# EAGLE schematic ACS schematic (EAGLE 8.6.0)
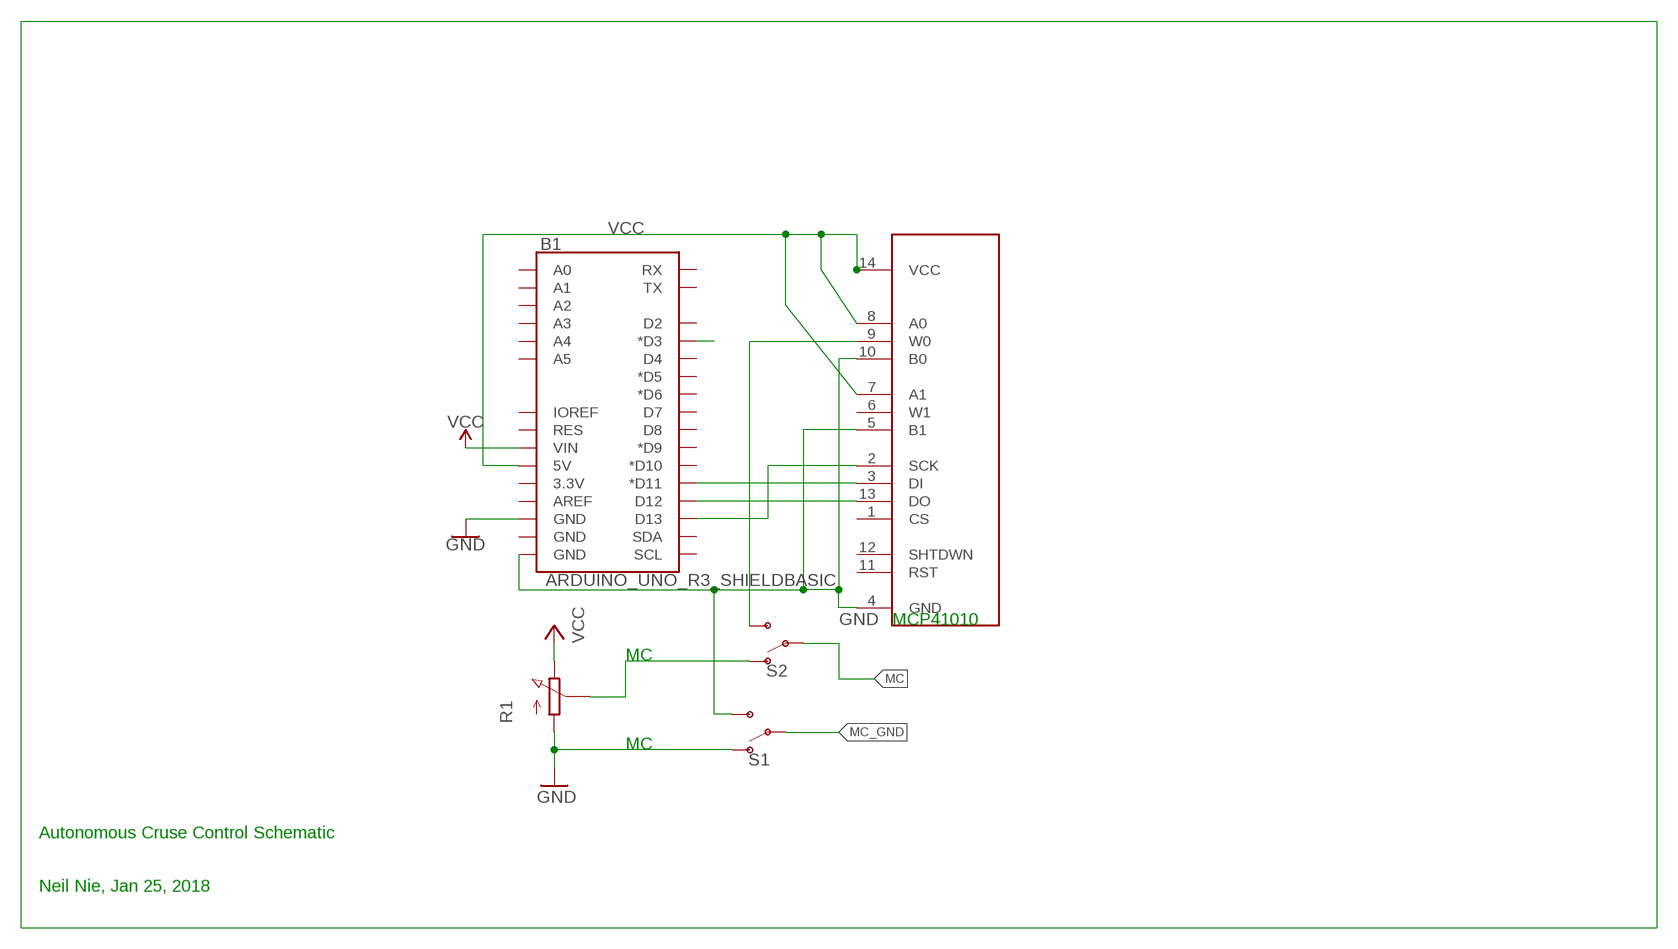
[diagram p0: schematic, sheet 1]

## Parts
B1  ARDUINO_UNO_R3_SHIELDBASIC  [UNO_R3_SHIELD]
MCP41010  MCP42XXX  [SO014]
R1  PC25  [PC25]
S1  SWITCH-SPDT-PTH-11.6X4.0MM  [SWITCH_SPDT_PTH_11.6X4.0MM]
S2  SWITCH-SPDT-PTH-11.6X4.0MM  [SWITCH_SPDT_PTH_11.6X4.0MM]

## Nets
GND: B1.GND@0(GND) B1.GND@2(GND) MCP41010.4(GND) MCP41010.5(B1) MCP41010.10(B0) R1.A S1.1(O) S1.3(S)
MC: S2.2(P)
MC_GND: S1.2(P)
N$1: B1.D13 MCP41010.2(SCK)
N$2: B1.D11(*D11) MCP41010.3(DI)
N$3: B1.D12 MCP41010.13(DO)
N$9: B1.D3(*D3)
N$10: R1.S S2.1(O)
VCC: B1.5V B1.VIN MCP41010.7(A1) MCP41010.8(A0) MCP41010.14(VCC) R1.E
W0: MCP41010.9(W0) S2.3(S)
Unconnected: B1.3.3V B1.A0 B1.A1 B1.A2 B1.A3 B1.A4 B1.A5 B1.AREF B1.D2 B1.D4 B1.D5(*D5) B1.D6(*D6) B1.D7 B1.D8 B1.D9(*D9) B1.D10(*D10) B1.GND@1(GND) B1.IOREF B1.RES B1.RX B1.SCL B1.SDA B1.TX MCP41010.1(CS) MCP41010.6(W1) MCP41010.11(RST) MCP41010.12(SHTDWN)

## Notes on the sheet
- MCP41010
- MC
- MC
- Autonomous Cruse Control Schematic
- Neil Nie, Jan 25, 2018

## Library data of the parts
B1 = SparkFun-Boards:ARDUINO_UNO_R3_SHIELD: Arduino R3 Shield Footprint Shield form compatible with the Arduino Uno R3. SparkFun Products: MG2639 Cellular Shield <https://www.sparkfun.com/products/13120> MIDI Shield <https://www.sparkfun.com/products/12898> R3 Stackable Headers Kit <https://www.sparkfun.com/products/11417>
MCP41010 = SparkFun-Retired:MCP42XXX: SPI controlled dual digital potentiometer by Microchip Not in catalog?
R1 = pot-vitrohm:PC25: VITROHM POTENTIOMETER; MF: CLAROSTAT; MPN: 308NPC25KS; OC_FARNELL: 1440998; OC_NEWARK: 03F7518
S1 S2 = SparkFun-Switches:SWITCH-SPDT: Single Pole, Double Throw (SPDT) Switch Single-pole, double-throw (SPDT) switch. Variant Overview SMD-AYZ0202 Surface Mount DPDT Switch <https://www.sparkfun.com/products/597> (COM-00597) Used on e.g. LilyPad Arduino USB - ATmega32U4 Board <https://www.sparkfun.com/products/12049> PTH-11.6X4.0MM SPDT Mini Power Switch <https://www.sparkfun.com/products/102> (COM-00102) Used on e.g. SparkFun Simon Says - Through-Hole Soldering Kit <https://www.sparkfun.com/products/10547> (KIT-10547) PTH-11.6X4.0MM-KIT KIT version of SPDT Mini Power Switch - Simplifies soldering by removing tStop of switch pins - only one side can be soldered. PTH-11.6X4.0MM-LOCK LOCK version of SPDT Mini Power Switch - Offset pins hold switch in place for easier soldering. SMD-RIGHT-ANGLE Surface Mount Right Angle Switch <https://www.sparkfun.com/products/10860> (COM-10860) Used on e.g. SparkFun ESP8266 Thing <https://www.sparkfun.com/products/13231>; PROD_ID: SWCH-08261; SF_SKU: COM-00102